# EAGLE schematic flexo_wiring_teensy_3_2 (EAGLE 9.2.2)
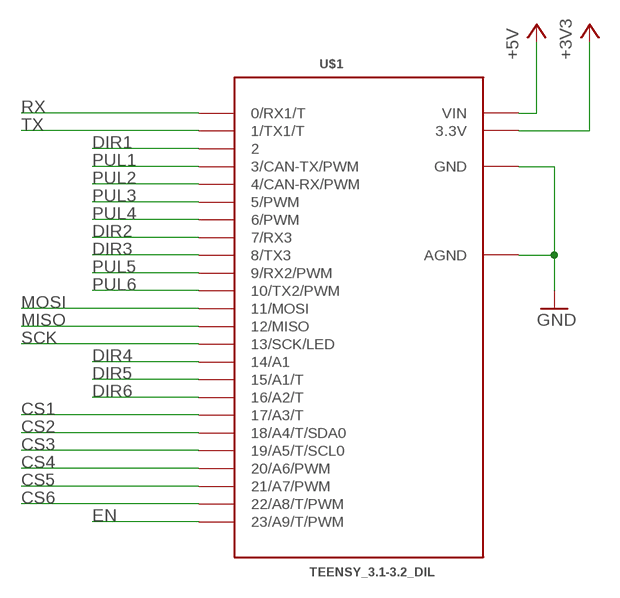
[diagram p0: schematic, sheet 1]

## Parts
U$1  TEENSY_3.1-3.2_DIL  [TEENSY_3.0-3.2&LC_DIL]

## Nets
+3V3: U$1.3.3V
+5V: U$1.VIN
CS1: U$1.17/A3(17/A3/T)
CS2: U$1.18/A4(18/A4/T/SDA0)
CS3: U$1.19/A5(19/A5/T/SCL0)
CS4: U$1.20/A6(20/A6/PWM)
CS5: U$1.21/A7(21/A7/PWM)
CS6: U$1.22/A8(22/A8/T/PWM)
DIR1: U$1.2
DIR2: U$1.7(7/RX3)
DIR3: U$1.8(8/TX3)
DIR4: U$1.14/A0(14/A1)
DIR5: U$1.15/A1(15/A1/T)
DIR6: U$1.16/A2(16/A2/T)
EN: U$1.23/A9(23/A9/T/PWM)
GND: U$1.AGND U$1.GND
MISO: U$1.12(12/MISO)
MOSI: U$1.11(11/MOSI)
PUL1: U$1.3(3/CAN-TX/PWM)
PUL2: U$1.4(4/CAN-RX/PWM)
PUL3: U$1.5(5/PWM)
PUL4: U$1.6(6/PWM)
PUL5: U$1.9(9/RX2/PWM)
PUL6: U$1.10(10/TX2/PWM)
RX: U$1.0(0/RX1/T)
SCK: U$1.13(13/SCK/LED)
TX: U$1.1(1/TX1/T)

## Library data of the parts
U$1 = Teensy_3_and_LC_Series_Boards_v1.4:TEENSY_3.1-3.2_DIL: Teensy 3.1 or 3.2 in a DIL Layout.